# EAGLE schematic buck_connector-2 (EAGLE 8.6.0)
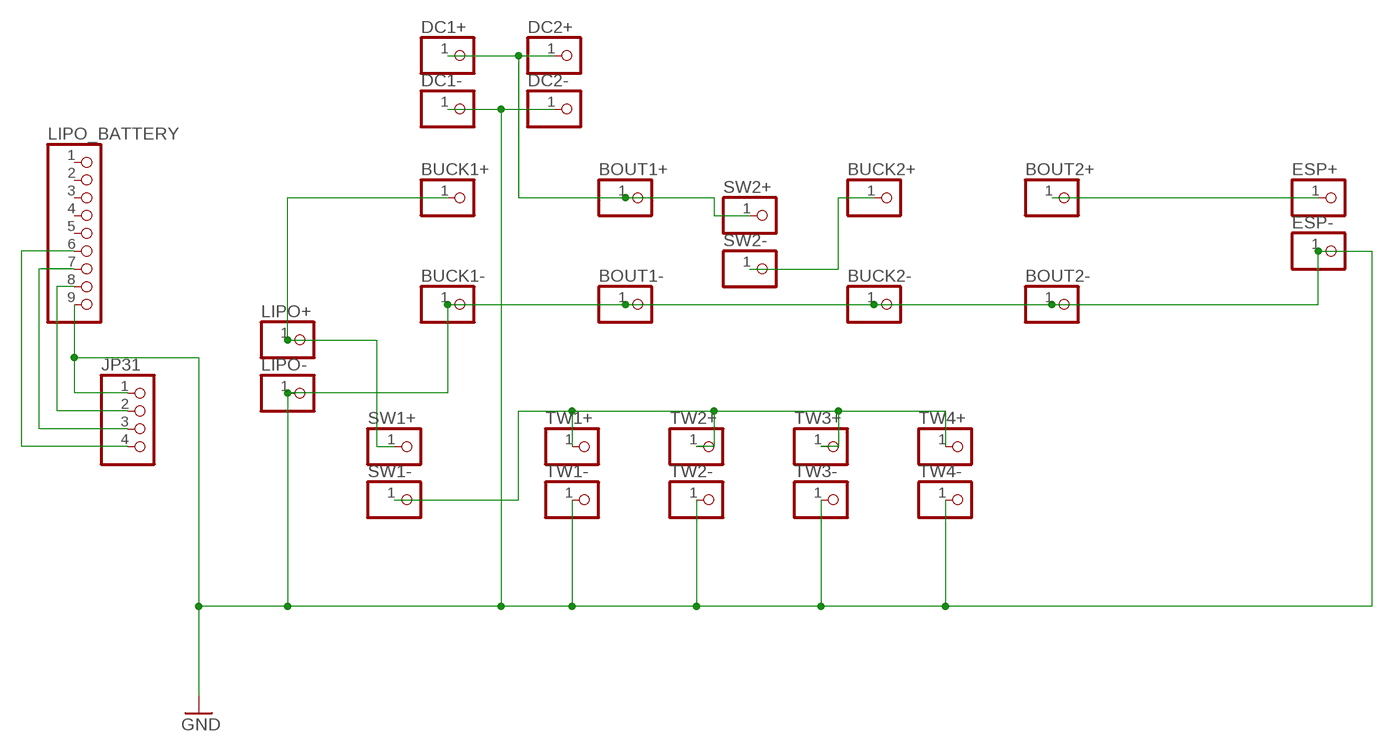
[diagram p0: schematic, sheet 1]

## Parts
BOUT1+  PINHD-1X1  [1X01]
BOUT1-  PINHD-1X1  [1X01]
BOUT2+  PINHD-1X1  [1X01]
BOUT2-  PINHD-1X1  [1X01]
BUCK1+  PINHD-1X1  [1X01]
BUCK1-  PINHD-1X1  [1X01]
BUCK2+  PINHD-1X1  [1X01]
BUCK2-  PINHD-1X1  [1X01]
DC1+  PINHD-1X1  [1X01]
DC1-  PINHD-1X1  [1X01]
DC2+  PINHD-1X1  [1X01]
DC2-  PINHD-1X1  [1X01]
ESP+  PINHD-1X1  [1X01]
ESP-  PINHD-1X1  [1X01]
JP31  PINHD-1X4  [1X04]
LIPO+  PINHD-1X1  [1X01]
LIPO-  PINHD-1X1  [1X01]
LIPO_BATTERY  PINHD-1X9  [1X09]
SW1+  PINHD-1X1  [1X01]
SW1-  PINHD-1X1  [1X01]
SW2+  PINHD-1X1  [1X01]
SW2-  PINHD-1X1  [1X01]
TW1+  PINHD-1X1  [1X01]
TW1-  PINHD-1X1  [1X01]
TW2+  PINHD-1X1  [1X01]
TW2-  PINHD-1X1  [1X01]
TW3+  PINHD-1X1  [1X01]
TW3-  PINHD-1X1  [1X01]
TW4+  PINHD-1X1  [1X01]
TW4-  PINHD-1X1  [1X01]

## Nets
GND: BOUT1-.1 BOUT2-.1 BUCK1-.1 BUCK2-.1 DC1-.1 DC2-.1 ESP-.1 JP31.1 LIPO-.1 LIPO_BATTERY.9 TW1-.1 TW2-.1 TW3-.1 TW4-.1
N$1: SW1-.1 TW1+.1 TW2+.1 TW3+.1 TW4+.1
N$2: JP31.2 LIPO_BATTERY.8
N$3: JP31.3 LIPO_BATTERY.7
N$4: JP31.4 LIPO_BATTERY.6
N$5: BOUT2+.1 ESP+.1
N$6: BUCK1+.1 LIPO+.1 SW1+.1
N$7: BOUT1+.1 DC1+.1 DC2+.1 SW2+.1
N$8: BUCK2+.1 SW2-.1
Unconnected: LIPO_BATTERY.1 LIPO_BATTERY.2 LIPO_BATTERY.3 LIPO_BATTERY.4 LIPO_BATTERY.5

## Library data of the parts
BOUT1+ BOUT1- BOUT2+ BOUT2- BUCK1+ BUCK1- BUCK2+ BUCK2- DC1+ DC1- DC2+ DC2- ESP+ ESP- LIPO+ LIPO- SW1+ SW1- SW2+ SW2- TW1+ TW1- TW2+ TW2- TW3+ TW3- TW4+ TW4- = pinhead:PINHD-1X1: PIN HEADER
JP31 = pinhead:PINHD-1X4: PIN HEADER
LIPO_BATTERY = pinhead:PINHD-1X9: PIN HEADER